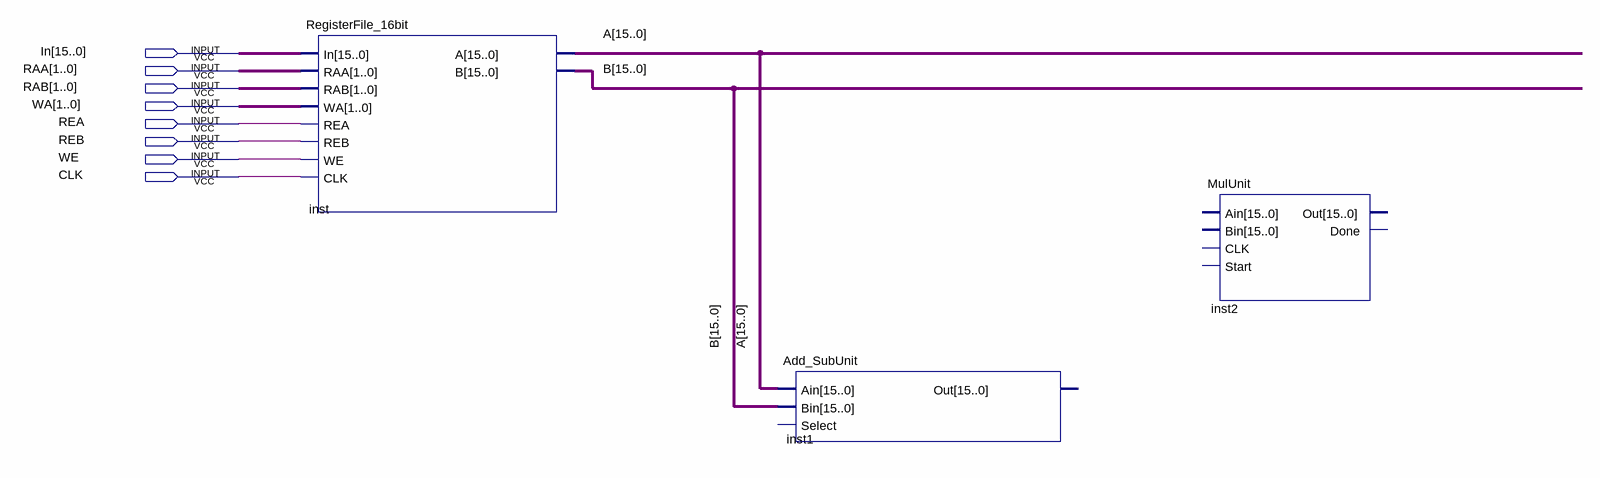
[diagram p0: schematic sheet]
// Quartus schematic Datapath.bdf as structural Verilog: 3 symbols, 8 pins
module Datapath (
  input  [15:0] In,
  input  [1:0] RAA,
  input  [1:0] RAB,
  input  [1:0] WA,
  input  REA,
  input  REB,
  input  WE,
  input  CLK
);

  wire [15:0] A, B;

  RegisterFile_16bit inst (
    .In(In), .RAA(RAA), .RAB(RAB), .WA(WA), .REA(REA), .REB(REB), .WE(WE), .CLK(CLK), .A(A), .B(B));
  Add_SubUnit inst1 (.Ain(A), .Bin(B));  // open: Select, Out
  MulUnit inst2 ();  // open: Ain, Bin, CLK, Start, Out, Done
endmodule
